# EAGLE design adapter (EAGLE 7.3.0)
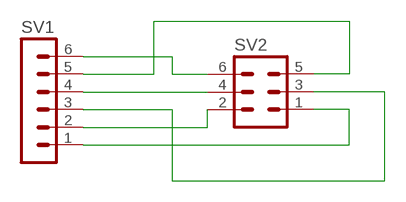
[diagram p0: schematic, sheet 1]

## Parts
SV1  MA06-1  [MA06-1]
SV2  MA03-2  [MA03-2]

## Nets
N$1: SV1.1 SV2.1
N$2: SV1.2 SV2.2
N$3: SV1.3 SV2.3
N$4: SV1.4 SV2.4
N$5: SV1.5 SV2.5
N$6: SV1.6 SV2.6

## Library data of the parts
SV1 = con-lstb:MA06-1: PIN HEADER; OC_FARNELL: unknown; OC_NEWARK: unknown
SV2 = pogopins:MA03-2: PIN HEADER; OC_FARNELL: unknown; OC_NEWARK: unknown

## Board
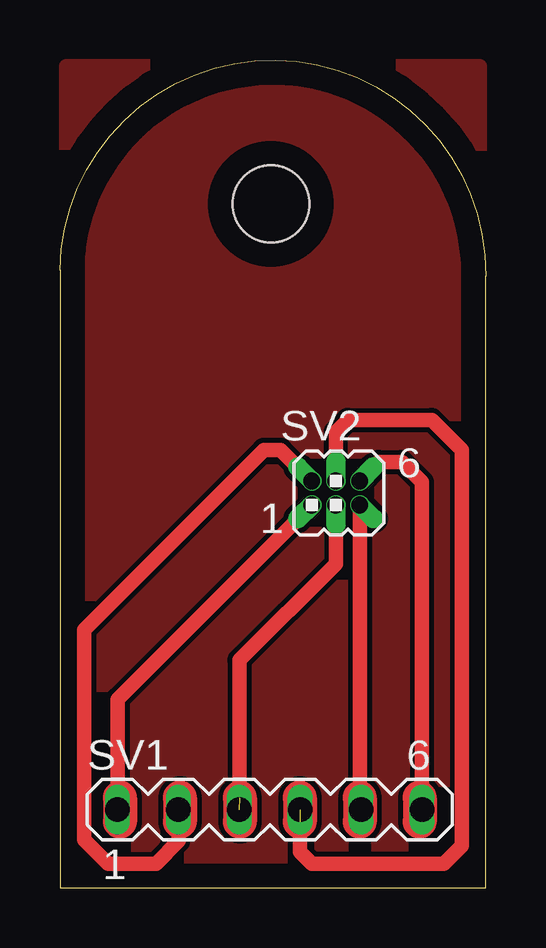
[diagram p1: board, top side]

Size 17.75 x 34.5 mm. Coordinates in mm from the lower left corner, seen from the top.
Outline: 0,0 17.75,0 17.75,25.5 arc180 0,25.75 0,0
Copper layers 1: Top 0.035mm
Design rules "default *": minimum track width 0.6mm, minimum drill 24mil, track to track 7mil, track to pad 7mil, pad to pad 7mil, via to via 7mil, smd to smd 7mil, copper to edge 40mil, drill to drill 8mil, minimum pad ring 0mil, minimum via ring 0mil, stop-mask expansion 4mil, vias tented up to drill 0mil, thermal gap 10mil
Holes 3.2 mm at 8.8,28.5

### Footprints (pad centres in the part's own frame; a part is rotated, then mirrored left to right if it is on the bottom)
MA06-1 = drill 1.016 long: 1 -6.35,0; 2 -3.81,0; 3 -1.27,0; 4 1.27,0; 5 3.81,0; 6 6.35,0
MA03-2 = drill 0.7 pad 0.813 offset: 1 -1,-0.5; 2 -1,0.5; 3 0,-0.5; 4 0,0.5; 5 1,-0.5; 6 1,0.5

### Placement (x,y rotation side)
SV1  8.75,3.25 0 top
SV2  11.5,16.45 0 top

### Tracks (layer width: path | path; a pad name or v marks a point on that pad's centre or on a via)
N$1
  Top 0.6: SV2.1 2.4,7.85 SV1.1
N$2
  Top 0.6: SV2.2 9.2,18.25 8.5,18.25 1,10.75 1,2 2,1 4,1 4.94,1.94 SV1.2
N$3  (1 unrouted)
  Top 0.6: SV2.3 11.5,13.5 7.48,9.48 SV1.3
  Top 1.422: 7.5,3.75 7.5,2.75
N$4  (1 unrouted)
  Top 0.6: SV2.4 11.5,19 12,19.5 15.5,19.5 16.75,18.25 16.75,1.75 16,1 10.5,1 10,1.5 10,3.23 SV1.4
  Top 1.422: 10,3.75 10,2.75
N$5
  Top 0.6: SV2.5 12.5,4.25 12.56,3.56 SV1.5
N$6
  Top 0.6: SV2.6 13.3,17.75 14.25,17.75 15.1,16.9 SV1.6
S$1
  Top 1.422: 2.5,3.75 2.5,2.75
S$2
  Top 1.422: 5,3.75 5,2.75
S$3
  Top 1.422: 12.5,3.75 12.5,2.75
S$4
  Top 1.422: 15,3.75 15,2.75
S$5
  pour Top (isolate 0.2): 0.25,34.25 17.5,34.25 17.5,0.25 0.25,0.25